# EAGLE design esp_LedControl (EAGLE 9.5.2)
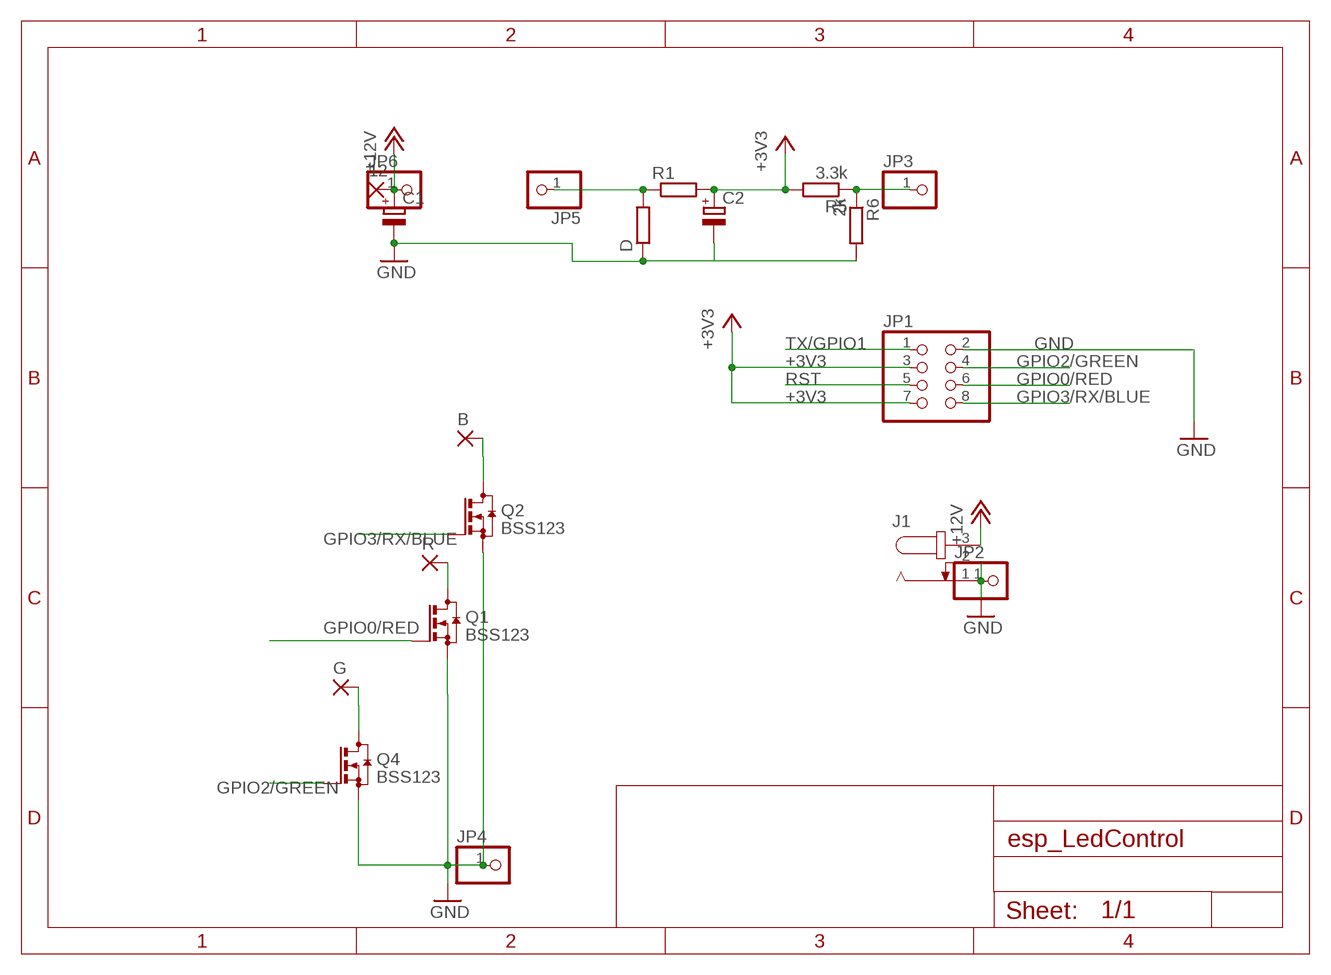
[diagram p0: schematic, sheet 1]

## Parts
12  3,17/1,3  [3,17/1,3]
B  3,17/1,3  [3,17/1,3]
C1  CPOL-EUE2.5-5  [E2,5-5]
C2  CPOL-EUE2.5-5  [E2,5-5]
D  R-EU_0204/7  [0204/7]
G  3,17/1,3  [3,17/1,3]
J1  JACK-PLUG0  [SPC4077]
JP1  PINHD-2X4  [2X04]
JP2  PINHD-1X1  [1X01]
JP3  PINHD-1X1  [1X01]
JP4  PINHD-1X1  [1X01]
JP5  PINHD-1X1  [1X01]
JP6  PINHD-1X1  [1X01]
Q1  BSS123  [SOT23]
Q2  BSS123  [SOT23]
Q4  BSS123  [SOT23]
R  3,17/1,3  [3,17/1,3]
R1  R-EU_0204/7  [0204/7]
R5  3.3k  R-EU_R0805  [R0805]
R6  2k  R-EU_R0805  [R0805]

## Nets
+3V3: C2.+ JP1.3 JP1.7 R1.2 R5.2
+12V: 12.1(P) C1.+ J1.3 JP6.1
GND: C1.- C2.- D.1 J1.1 J1.2 JP1.2 JP2.1 JP4.1 Q1.2(S) Q2.2(S) Q4.2(S) R6.2
GPIO0/RED: JP1.6 Q1.1(G)
GPIO2/GREEN: JP1.4 Q4.1(G)
GPIO3/RX/BLUE: JP1.8 Q2.1(G)
N$1: G.1(P) Q4.3(D)
N$2: JP3.1 R5.1 R6.1
N$3: B.1(P) Q2.3(D)
N$4: D.2 JP5.1 R1.1
N$10: Q1.3(D) R.1(P)
RST: JP1.5
TX/GPIO1: JP1.1

## Library data of the parts
12 B G R = wirepad:3,17/1,3: THROUGH-HOLE PAD
C1 C2 = rcl:CPOL-EU: POLARIZED CAPACITOR, European symbol; SPICEPREFIX: C
D R1 R5 R6 = rcl:R-EU_: RESISTOR, European symbol; SPICEPREFIX: R
J1 = con-jack:JACK-PLUG: DC POWER JACK Power Jack, DC, Right Angle, Through Hole, Rated 5A at 16VDC, PC Terminals Distributor: Farnell (www.Farnell.de) Drawing: 84N1161.pdf / 84N1162.pdf Manufacturer: SPC Technology (www.spctechnology.com) Type: SPC4077 / SPC 4078; OC_FARNELL: unknown; OC_NEWARK: unknown
JP1 = pinhead:PINHD-2X4: PIN HEADER
JP2-JP6 = pinhead:PINHD-1X1: PIN HEADER
Q1 Q2 Q4 = transistor-small-signal:BSS123: N-CHANNEL MOS FET

## Board
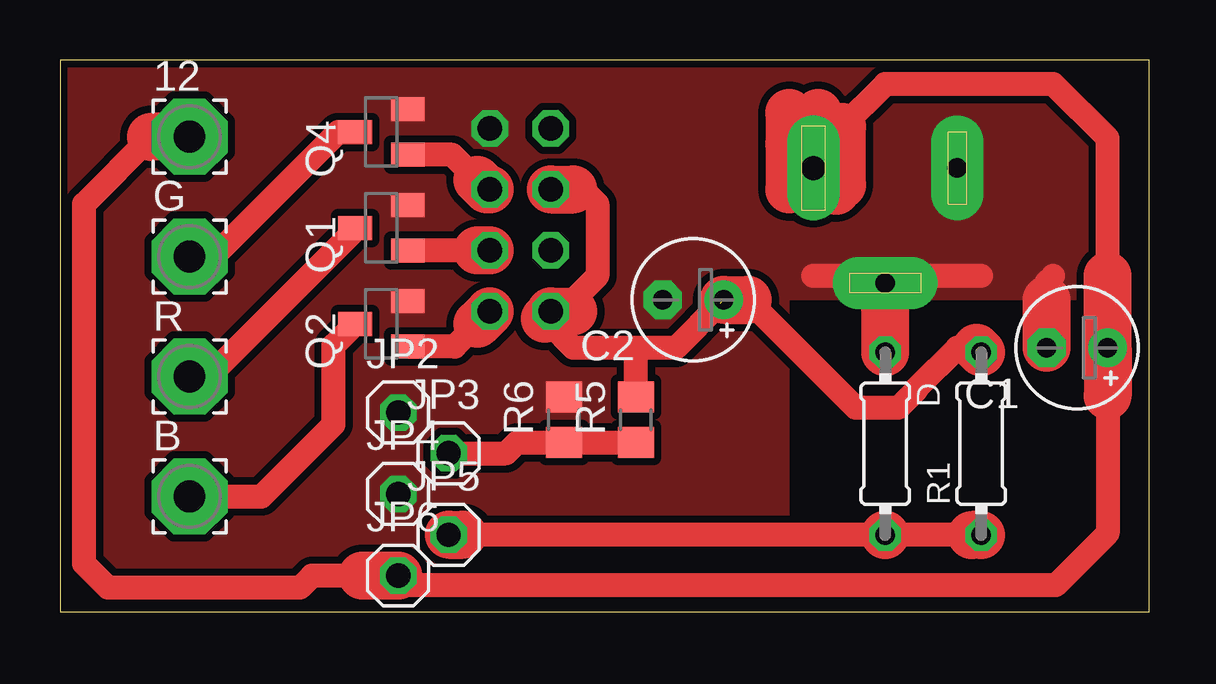
[diagram p1: board, top side]
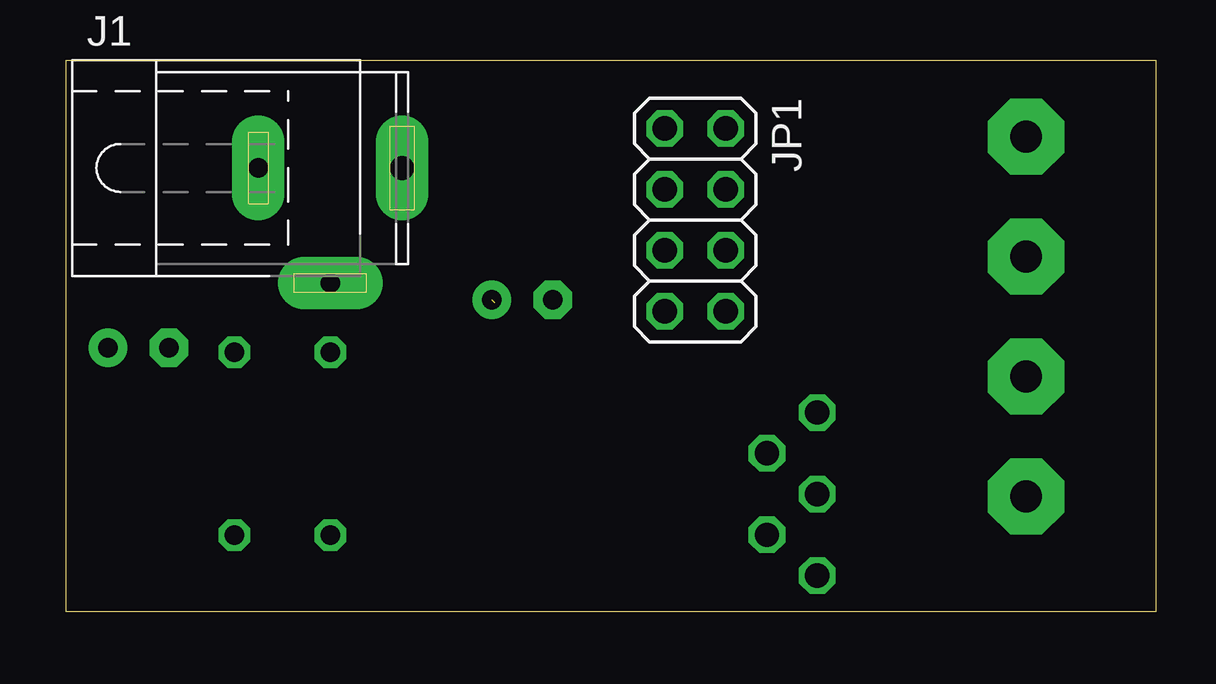
[diagram p2: board, bottom side, seen from below]

Size 45.4 x 23 mm. Coordinates in mm from the lower left corner, seen from the top.
Outline: 0,0 45.4,0 45.4,23 0,23 0,0
Copper layers (1*16): Top 0.035mm / dielectric 1.5mm / Bottom 0.035mm
Design rules "default *": minimum track width 6mil, minimum drill 0.35mm, track to track 6mil, track to pad 6mil, pad to pad 6mil, via to via 6mil, smd to smd 6mil, copper to edge 5mil, drill to drill 6mil, minimum pad ring 10mil, minimum via ring 8mil, stop-mask expansion 4mil, vias tented up to drill 0mil, thermal gap 10mil

### Footprints (pad centres in the part's own frame; a part is rotated, then mirrored left to right if it is on the bottom)
3,17/1,3 = drill 1.321 pad 3.175 octagon: 1 0,0
E2,5-5 = drill 0.813 pad 1.6: + -1.27,0 | drill 0.813 pad 1.6 octagon: - 1.27,0
0204/7 = drill 0.813 octagon: 1 -3.81,0; 2 3.81,0
SPC4077 = drill 0.8 pad 2.184 long: 1 -3,0; 2 0,-4.8 | drill 1 pad 2.184 long: 3 3,0
2X04 = drill 1.016 octagon: 1 -3.81,-1.27; 2 -3.81,1.27; 3 -1.27,-1.27; 4 -1.27,1.27; 5 1.27,-1.27; 6 1.27,1.27; 7 3.81,-1.27; 8 3.81,1.27
1X01 = drill 1.016 octagon: 1 0,0
SOT23 = smd 1 x 1.4: 1 -0.95,-1.1; 2 0.95,-1.1; 3 0,1.1
R0805 = smd 1.3 x 1.5: 1 -0.95,0; 2 0.95,0

### Placement (x,y rotation side)
12  5.4,19.8 0 top
B  5.4,4.8 0 top
C1  42.4,11 180 top
C2  26.4,13 180 top
D  34.4,7 270 top
G  5.4,14.8 0 top
J1  34.4,18.5 0 bottom
JP1  19.19,16.33 270 bottom
JP2  14.1,8.3 0 top
JP3  16.2,6.6 0 top
JP4  14.1,4.9 0 top
JP5  16.2,3.2 0 top
JP6  14.1,1.5 0 top
Q1  13.4,16 90 top
Q2  13.4,12 90 top
Q4  13.4,20 90 top
R  5.4,9.8 0 top
R1  38.4,7 90 top
R5  24,8 90 top
R6  21,8 90 top

### Tracks (layer width: path | path; a pad name or v marks a point on that pad's centre or on a via)
+3V3  (1 unrouted)
  Top 1: 21.4,17.6 21.8,17.6 22.4,17 22.4,14 20.92,12.52 JP1.7 | 27.54,12.87 25.67,11 24,11 | 24,11 21.4,11 20.46,11.94 20.46,12.46 | 38.21,11 37.4,11 35.71,9.31 35.71,9.27 34.94,8.5 33.17,8.5 28.67,13 | R5.2 24,11
  Top 2: 21.4,12.52 JP1.7 20.46,12.46 20.2,12.2 | JP1.3 21.4,17.6 | R1.2 38.21,11 | C2.+ 28.67,13
+12V
  Top 1: 43.67,9 43.67,3.27 41.5,1.1 14.5,1.1 JP6.1 | 43.67,14 43.67,19.73 41.4,22 34.4,22 32.6,20.2 | 12.6,1.5 10.5,1.5 10,1 2,1 1,2 1,17 3.8,19.8
  Top 2: 43.67,14 C1.+ 43.67,9 | JP6.1 12.6,1.5 | J1.3 31.4,17.8 31.6,17.6 | J1.3 31.4,20.6 31.6,20.8 | J1.3 32.35,17.55 32.6,17.8 32.6,20.2 | 30.4,20.8 30.4,19.5 | J1.3 30.4,19.5 | 30.4,19.5 30.4,17.6 | 12.1 3.8,19.8
GND
  Top 1: 38.4,14 34.7,14 J1.2 | D.1 34.4,13 33.4,14 31.4,14 | 41.13,13 41.13,13.73 41.4,14
  Top 2: D.1 J1.2 | C1.- 41.13,13
  pour Top (isolate 0.3, no thermals): 0,23 0,0 30.4,0 30.4,13 45.4,13 45.4,23
GPIO0/RED
  Top 1: 17.4,15.06 Q1.1
  Top 2: JP1.6 17.4,15.06
GPIO2/GREEN
  Top 1: Q4.1 16.35,19.05 17.4,18
  Top 2: JP1.4 17.8,17.6 17.4,18
GPIO3/RX/BLUE
  Top 1: 17.4,12 16.45,11.05 Q2.1
  Top 2: JP1.8 17.4,12
N$1
  Top 1: Q4.3 11.6,20 6.4,14.8 G.1
N$2
  Top 1: JP3.1 18.6,6.6 19.05,7.05 R6.1 R5.1
N$3
  Top 1: B.1 8.4,4.8 11.4,7.8 11.4,11.1 Q2.3
N$4
  Top 1: D.2 16.8,3.2 | 38,3.19 D.2
  Top 2: JP5.1 16.8,3.2 | D.2 | R1.1 38,3.19
N$10
  Top 1: R.1 6.2,9.8 12.3,15.9 Q1.3